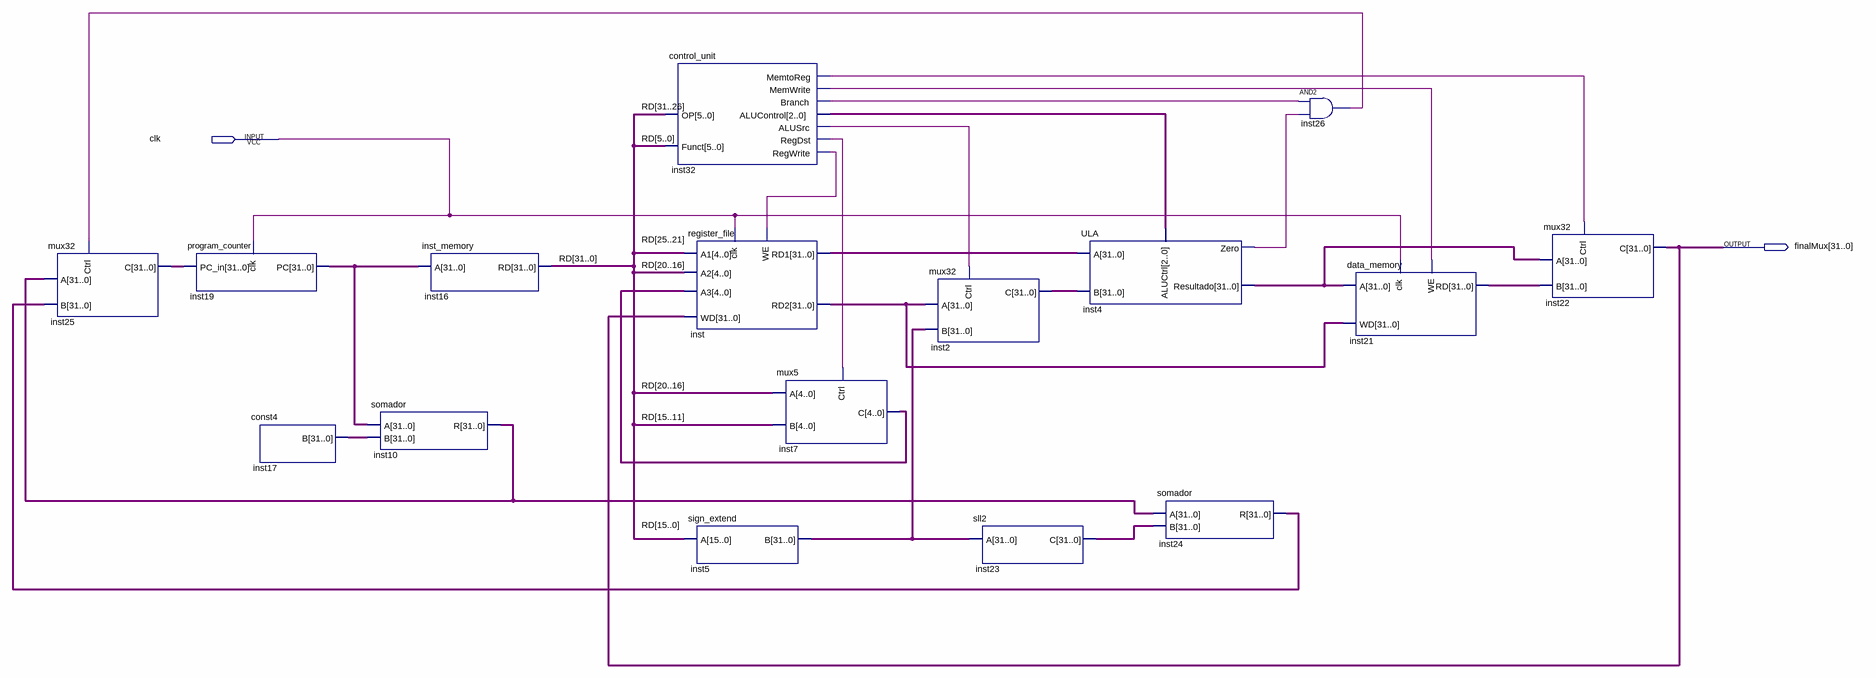
[diagram p0: schematic sheet]
// Quartus schematic MIPS_GNM_v1_1.bdf as structural Verilog: 16 symbols, 2 pins
module MIPS_GNM_v1_1 (
  input  clk,
  output [31:0] finalMux
);

  wire inst4_zero, inst26_out, inst32_alusrc, inst32_branch, inst32_memtoreg, inst32_memwrite, inst32_regdst,
       inst32_regwrite;
  wire [2:0] inst32_alucontrol;
  wire [4:0] inst7_c;
  wire [31:0] inst2_c, inst4_resultado, inst5_b, inst10_r, inst17_b, inst19_pc, inst21_rd, inst23_c,
       inst24_r, inst25_c, inst_rd1, inst_rd2, RD;

  mux32 inst25 (.A(inst10_r), .B(inst24_r), .Ctrl(inst26_out), .C(inst25_c));
  program_counter inst19 (.clk(clk), .PC_in(inst25_c), .PC(inst19_pc));
  const4 inst17 (.B(inst17_b));
  somador inst10 (.A(inst19_pc), .B(inst17_b), .R(inst10_r));
  inst_memory inst16 (.A(inst19_pc), .RD(RD));
  control_unit inst32 (
    .OP(RD[31:26]), .Funct(RD[5:0]), .MemtoReg(inst32_memtoreg), .MemWrite(inst32_memwrite),
    .Branch(inst32_branch), .ALUSrc(inst32_alusrc), .RegDst(inst32_regdst), .RegWrite(inst32_regwrite),
    .ALUControl(inst32_alucontrol));
  register_file inst (
    .clk(clk), .WE(inst32_regwrite), .A1(RD[25:21]), .A2(RD[20:16]), .A3(inst7_c), .WD(finalMux),
    .RD1(inst_rd1), .RD2(inst_rd2));
  sign_extend inst5 (.A(RD[15:0]), .B(inst5_b));
  mux5 inst7 (.A(RD[20:16]), .B(RD[15:11]), .Ctrl(inst32_regdst), .C(inst7_c));
  mux32 inst2 (.A(inst_rd2), .B(inst5_b), .Ctrl(inst32_alusrc), .C(inst2_c));
  sll2 inst23 (.A(inst5_b), .C(inst23_c));
  ULA inst4 (.A(inst_rd1), .B(inst2_c), .ALUCtrl(inst32_alucontrol), .Resultado(inst4_resultado), .Zero(inst4_zero));
  somador inst24 (.A(inst10_r), .B(inst23_c), .R(inst24_r));
  and inst26 (inst26_out, inst32_branch, inst4_zero);
  data_memory inst21 (.clk(clk), .A(inst4_resultado), .WE(inst32_memwrite), .WD(inst_rd2), .RD(inst21_rd));
  mux32 inst22 (.A(inst4_resultado), .B(inst21_rd), .Ctrl(inst32_memtoreg), .C(finalMux));
endmodule
